# Altium schematic sheet Connectors2.SchDoc: SPI Connectors
size A; DrawnBy: Noah Chapman
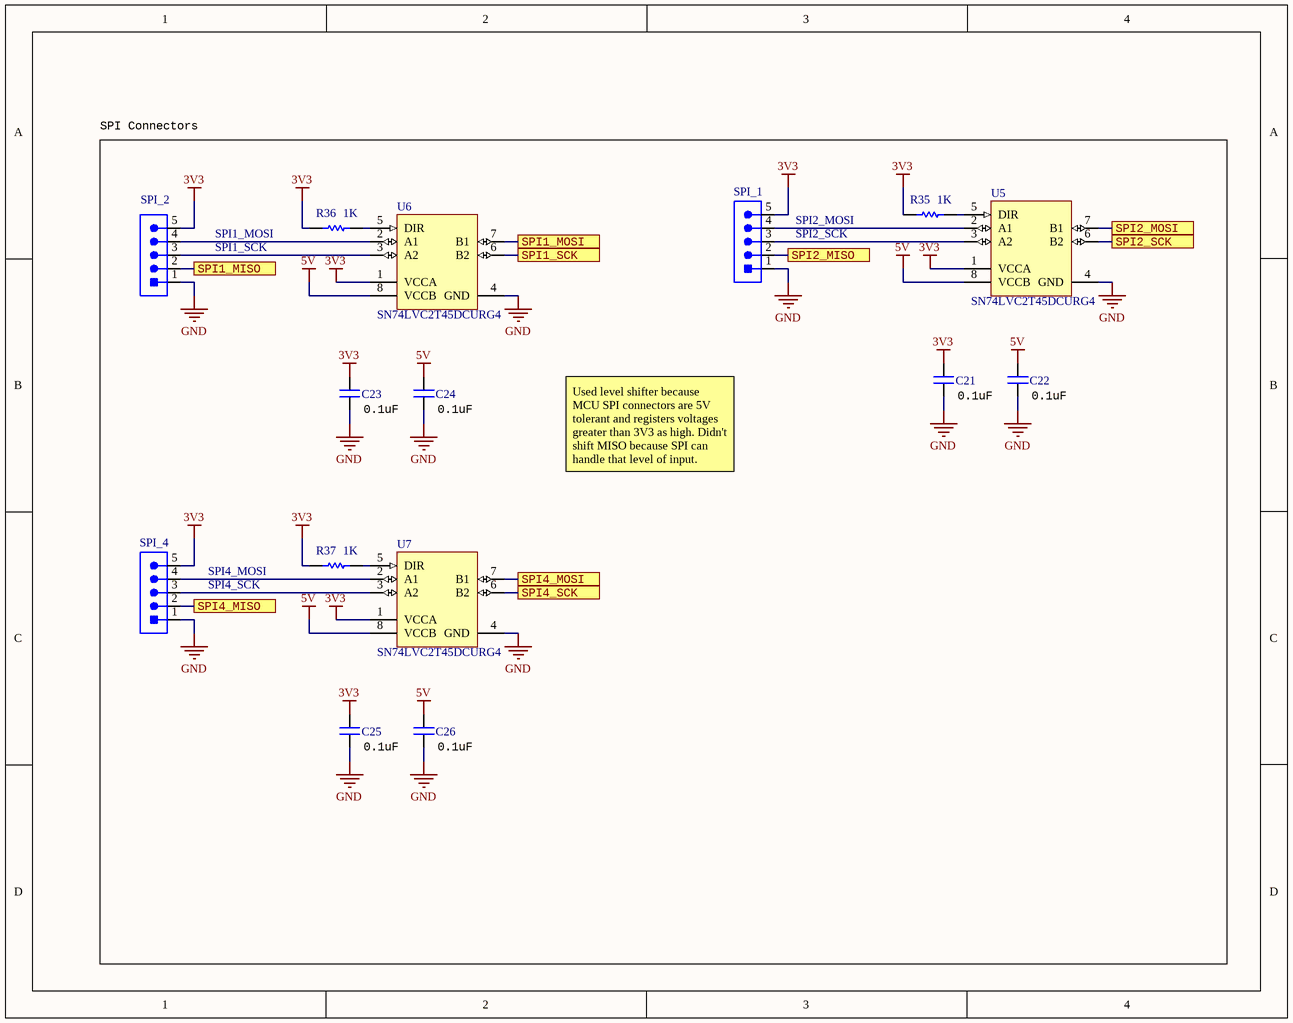
[diagram p0: Connectors2.SchDoc]

## Parts
C21  value 0.1uF  [CAPC0603(1608)55_N]  (hidden comment: CAP_0.1uF_16V_0603)
C22  value 0.1uF  [CAPC0603(1608)55_N]  (hidden comment: CAP_0.1uF_16V_0603)
C23  value 0.1uF  [CAPC0603(1608)55_N]  (hidden comment: CAP_0.1uF_16V_0603)
C24  value 0.1uF  [CAPC0603(1608)55_N]  (hidden comment: CAP_0.1uF_16V_0603)
C25  value 0.1uF  [CAPC0603(1608)55_N]  (hidden comment: CAP_0.1uF_16V_0603)
C26  value 0.1uF  [CAPC0603(1608)55_N]  (hidden comment: CAP_0.1uF_16V_0603)
R35  value 1K  [RESC0603(1608)_N]  (hidden comment: RES_1K_0603)
R36  value 1K  [RESC0603(1608)_N]  (hidden comment: RES_1K_0603)
R37  value 1K  [RESC0603(1608)_N]  (hidden comment: RES_1K_0603)
SPI_1  CON_5M  [JST-B5B-SM4-TB]  (value not drawn)
SPI_2  CON_5M  [JST-B5B-SM4-TB]  (value not drawn)
SPI_4  CON_5M  [JST-B5B-SM4-TB]  (value not drawn)
U5  SN74LVC2T45DCURG4  [DCU0008A_L]
U6  SN74LVC2T45DCURG4  [DCU0008A_L]
U7  SN74LVC2T45DCURG4  [DCU0008A_L]

## Ports
SPI1_MISO, SPI1_MOSI, SPI1_SCK, SPI2_MISO, SPI2_MOSI, SPI2_SCK, SPI4_MISO, SPI4_MOSI, SPI4_SCK

## Nets
3V3: C21.2 C23.2 C25.2 R35.1 R36.1 R37.1 SPI_1.5 SPI_2.5 SPI_4.5 U5.1(VCCA) U6.1(VCCA) U7.1(VCCA)
5V: C22.2 C24.2 C26.2 U5.8(VCCB) U6.8(VCCB) U7.8(VCCB)
GND: C21.1 C22.1 C23.1 C24.1 C25.1 C26.1 SPI_1.1 SPI_2.1 SPI_4.1 U5.4(GND) U6.4(GND) U7.4(GND)
SPI1_MISO: SPI_2.2 ; port SPI1_MISO
SPI1_MOSI: U6.7(B1) ; port SPI1_MOSI
SPI1_SCK: U6.6(B2) ; port SPI1_SCK
SPI2_MISO: SPI_1.2 ; port SPI2_MISO
SPI2_MOSI: U5.7(B1) ; port SPI2_MOSI
SPI2_SCK: U5.6(B2) ; port SPI2_SCK
SPI4_MISO: SPI_4.2 ; port SPI4_MISO
SPI4_MOSI: U7.7(B1) ; port SPI4_MOSI
SPI4_SCK: U7.6(B2) ; port SPI4_SCK
NetR35_2: R35.2 U5.5(DIR)
NetR36_2: R36.2 U6.5(DIR)
NetR37_2: R37.2 U7.5(DIR)
NetSPI_1_3: SPI_1.3 U5.3(A2)
NetSPI_1_4: SPI_1.4 U5.2(A1)
NetSPI_2_3: SPI_2.3 U6.3(A2)
NetSPI_2_4: SPI_2.4 U6.2(A1)
NetSPI_4_3: SPI_4.3 U7.3(A2)
NetSPI_4_4: SPI_4.4 U7.2(A1)

## Notes on the sheet
- SPI Connectors
- SPI1_MOSI
- (near SPI_1) SPI2_MOSI
- (near SPI_1) SPI2_SCK
- SPI1_SCK
- Used level shifter because MCU SPI connectors are 5V tolerant and registers voltages greater than 3V3 as high. Didn't shift MISO because SPI can handle that level of input.
- SPI4_MOSI
- (near SPI_4) SPI4_SCK

## Library data of the parts
C21-C26 = CAP_0.1uF_16V_0603: CAP CER 0.1UF 16V X7R 0603; MPN: CC0603KRX7R7BB104; Manufacturer: Yageo; Dimensions: 0.063" L x 0.031" W (1.60mm x 0.80mm); Package: 0603 (1608 Metric); Temperature Coefficient: X7R; Digikey Part Number: 311-1088-1-ND; Voltage Rating: 16V
R35-R37 = RES_1K_0603: RES SMD 1K OHM 5% 1/10W 0603; Manufacturer: Yageo; MPN: RC0603JR-071KL; Dimensions: 0.063" L x 0.031" W (1.60mm x 0.80mm); Tolerance: 5%; Package: 0603 (1608 Metric); Digikey Part Number: 311-1.0KGRCT-ND
U5-U7 = CMP-0859-00013-4: Dual-Bit Dual Supply Transceiver with Configurable Voltage Translation and 3-State Outputs, DCU0008A, LARGE T&R; Manufacturer: Texas Instruments; tpd @ Nom Voltage(Max)(ns): 17.7,10.3,8.3,7.2; Logic: True; Rating: Military; ICC @ Nom Voltage(Max)(mA): 0.004; Bits(#): 2; 3-State Output: Yes; Schmitt Trigger: No; Technology Family: LVC; Sub-Family: Dual Supply Translator; Output Drive (IOL/IOH)(Max)(mA): 32/-32; Output Type: CMOS; VCC(Max)(V): 5.5; Input Type: CMOS/TTL; F @ Nom Voltage(Max)(Mhz): 150; VCC(Min)(V): 1.65; Voltage(Nom)(V): 1.8,2.5,3.3,5; PackageReference: DCU0008A; Generic Part Number: SN74LVC2T45; DatasheetVersion: SCES516J; Operating Temperature Range(C): -40 to 85